# Altium schematic sheet MAX5875_5.SchDoc
size A; SheetNumber: 18; SheetTotal: 24
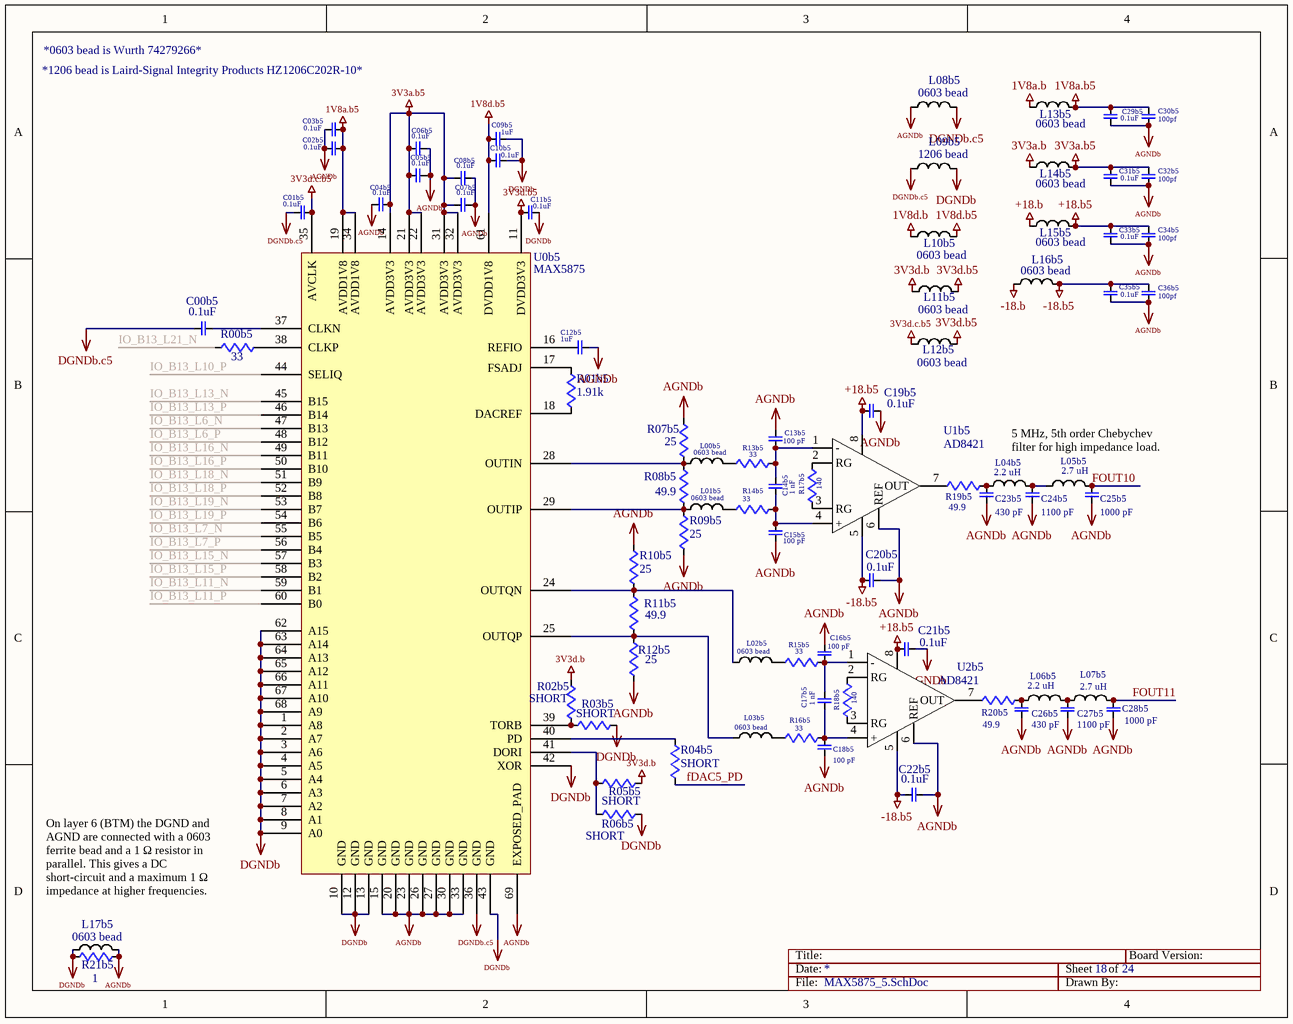
[diagram p0: MAX5875_5.SchDoc]

## Parts
C00b5  0.1uF  [0402]
C01b5  0.1uF  [0402]
C02b5  0.1uF  [0402]
C03b5  0.1uF  [0402]
C04b5  0.1uF  [0402]
C05b5  0.1uF  [0402]
C06b5  0.1uF  [0402]
C07b5  0.1uF  [0402]
C08b5  0.1uF  [0402]
C09b5  1uF  [0603]
C10b5  0.1uF  [0402]
C11b5  0.1uF  [0402]
C12b5  1uF  [0402]
C13b5  100 pF  [0603]
C14b5  1 nF  [0603]
C15b5  100 pF  [0603]
C16b5  100 pF  [0603]
C17b5  1 nF  [0603]
C18b5  100 pF  [0603]
C19b5  0.1uF  [0603]
C20b5  0.1uF  [0603]
C21b5  0.1uF  [0603]
C22b5  0.1uF  [0603]
C23b5  430 pF  [0603]
C24b5  1100 pF  [0603]
C25b5  1000 pF  [0603]
C26b5  430 pF  [0603]
C27b5  1100 pF  [0603]
C28b5  1000 pF  [0603]
C29b5  0.1uF  [0603]
C30b5  100pf  [0603]
C31b5  0.1uF  [0603]
C32b5  100pf  [0603]
C33b5  0.1uF  [0603]
C34b5  100pf  [0603]
C35b5  0.1uF  [0603]
C36b5  100pf  [0603]
L00b5  0603 bead  [0603]
L01b5  0603 bead  [0603]
L02b5  0603 bead  [0603]
L03b5  0603 bead  [0603]
L04b5  2.2 uH  [0603]
L05b5  2.7 uH  [0603]
L06b5  2.2 uH  [0603]
L07b5  2.7 uH  [0603]
L08b5  0603 bead  [0603]
L09b5  1206 bead  [1206]
L10b5  0603 bead  [0603]
L11b5  0603 bead  [0603]
L12b5  0603 bead  [0603]
L13b5  0603 bead  [0603]
L14b5  0603 bead  [0603]
L15b5  0603 bead  [0603]
L16b5  0603 bead  [0603]
L17b5  0603 bead  [0603]
R00b5  33  [0402]
R01b5  1.91k  [0603]
R02b5  SHORT  [0603]
R03b5  SHORT  [0603]
R04b5  SHORT  [0603]
R05b5  SHORT  [0603]
R06b5  SHORT  [0603]
R07b5  25  [0603]
R08b5  49.9  [0603]
R09b5  25  [0603]
R10b5  25  [0603]
R11b5  49.9  [0603]
R12b5  25  [0603]
R13b5  33  [0603]
R14b5  33  [0603]
R15b5  33  [0603]
R16b5  33  [0603]
R17b5  140  [0402]
R18b5  140  [0402]
R19b5  49.9  [0603]
R20b5  49.9  [0603]
R21b5  1  [0603]
U0b5  MAX5875  [68LQFN]
U1b5  AD8421  [8SOIC]
U2b5  AD8421  [8SOIC]

## Nets
1V8a.b: L13b5.1
1V8a.b5: C02b5.1 C03b5.2 C29b5.1 C30b5.1 L13b5.2 U0b5.19(AVDD1V8) U0b5.34(AVDD1V8)
1V8d.b: L10b5.1
1V8d.b5: C09b5.2 C10b5.2 L10b5.2 U0b5.61(DVDD1V8)
3V3a.b: L14b5.1
3V3a.b5: C04b5.1 C05b5.2 C06b5.1 C07b5.2 C08b5.1 C31b5.1 C32b5.1 L14b5.2 U0b5.14(AVDD3V3) U0b5.21(AVDD3V3) U0b5.22(AVDD3V3) U0b5.31(AVDD3V3) U0b5.32(AVDD3V3)
3V3d.b: L11b5.1 R02b5.2 R05b5.2
3V3d.b5: C11b5.2 L11b5.2 L12b5.2 U0b5.11(DVDD3V3)
3V3d.c.b5: C01b5.1 L12b5.1 U0b5.35(AVCLK)
+18.b: L15b5.1
+18.b5: C19b5.2 C21b5.2 C33b5.1 C34b5.1 L15b5.2 U1b5.8(+VS) U2b5.8(+VS)
-18.b: L16b5.1
-18.b5: C20b5.2 C22b5.2 C35b5.1 C36b5.1 L16b5.2 U1b5.5(-VS) U2b5.5(-VS)
AGNDb: C02b5.2 C03b5.1 C04b5.2 C05b5.1 C06b5.2 C07b5.1 C08b5.2 C12b5.1 C13b5.1 C15b5.1 C16b5.1 C18b5.1 C19b5.1 C20b5.1 C21b5.1 C22b5.1 C23b5.2 C24b5.2 C25b5.2 C26b5.2 C27b5.2 C28b5.2 C29b5.2 C30b5.2 C31b5.2 C32b5.2 C33b5.2 C34b5.2 C35b5.2 C36b5.2 L08b5.1 L17b5.2 R07b5.2 R09b5.1 R10b5.2 R12b5.1 R21b5.1 U0b5.15(GND) U0b5.20(GND) U0b5.23(GND) U0b5.26(GND) U0b5.27(GND) U0b5.30(GND) U0b5.33(GND) U0b5.69(EXPOSED_PAD) U1b5.6(REF) U2b5.6(REF)
DGNDb: C09b5.1 C10b5.1 C11b5.1 L09b5.2 L17b5.1 R03b5.2 R06b5.2 R21b5.2 U0b5.1(A8) U0b5.2(A7) U0b5.3(A6) U0b5.4(A5) U0b5.5(A4) U0b5.6(A3) U0b5.7(A2) U0b5.8(A1) U0b5.9(A0) U0b5.10(GND) U0b5.12(GND) U0b5.13(GND) U0b5.42(XOR) U0b5.43(GND) U0b5.62(A15) U0b5.63(A14) U0b5.64(A13) U0b5.65(A12) U0b5.66(A11) U0b5.67(A10) U0b5.68(A9)
DGNDb.c5: C00b5.2 C01b5.2 L08b5.2 L09b5.1 U0b5.36(GND)
fDAC5_PD: R04b5.2
FOUT10: C25b5.1 L05b5.2
FOUT11: C28b5.1 L07b5.2
IO_B13_L6_N: U0b5.47(B13)
IO_B13_L6_P: U0b5.48(B12)
IO_B13_L7_N: U0b5.55(B5)
IO_B13_L7_P: U0b5.56(B4)
IO_B13_L10_P: U0b5.44(SELIQ)
IO_B13_L11_N: U0b5.59(B1)
IO_B13_L11_P: U0b5.60(B0)
IO_B13_L13_N: U0b5.45(B15)
IO_B13_L13_P: U0b5.46(B14)
IO_B13_L15_N: U0b5.57(B3)
IO_B13_L15_P: U0b5.58(B2)
IO_B13_L16_N: U0b5.49(B11)
IO_B13_L16_P: U0b5.50(B10)
IO_B13_L18_N: U0b5.51(B9)
IO_B13_L18_P: U0b5.52(B8)
IO_B13_L19_N: U0b5.53(B7)
IO_B13_L19_P: U0b5.54(B6)
IO_B13_L21_N: R00b5.1
NetC00b5_1: C00b5.1 U0b5.37(CLKN)
NetC12b5_2: C12b5.2 U0b5.16(REFIO)
NetC13b5_2: C13b5.2 C14b5.1 R13b5.1 U1b5.1(-)
NetC14b5_2: C14b5.2 C15b5.2 R14b5.1 U1b5.4(+)
NetC16b5_2: C16b5.2 C17b5.1 R15b5.1 U2b5.1(-)
NetC17b5_2: C17b5.2 C18b5.2 R16b5.1 U2b5.4(+)
NetC23b5_1: C23b5.1 L04b5.1 R19b5.2
NetC24b5_1: C24b5.1 L04b5.2 L05b5.1
NetC26b5_1: C26b5.1 L06b5.1 R20b5.2
NetC27b5_1: C27b5.1 L06b5.2 L07b5.1
NetL00b5_1: L00b5.1 R07b5.1 R08b5.2 U0b5.28(OUTIN)
NetL00b5_2: L00b5.2 R13b5.2
NetL01b5_1: L01b5.1 R08b5.1 R09b5.2 U0b5.29(OUTIP)
NetL01b5_2: L01b5.2 R14b5.2
NetL02b5_1: L02b5.1 R10b5.1 R11b5.2 U0b5.24(OUTQN)
NetL02b5_2: L02b5.2 R15b5.2
NetL03b5_1: L03b5.1 R11b5.1 R12b5.2 U0b5.25(OUTQP)
NetL03b5_2: L03b5.2 R16b5.2
NetR00b5_2: R00b5.2 U0b5.38(CLKP)
NetR01b5_1: R01b5.1 U0b5.18(DACREF)
NetR01b5_2: R01b5.2 U0b5.17(FSADJ)
NetR02b5_1: R02b5.1 R03b5.1 U0b5.39(TORB)
NetR04b5_1: R04b5.1 U0b5.40(PD)
NetR05b5_1: R05b5.1 R06b5.1 U0b5.41(DORI)
NetR17b5_1: R17b5.1 U1b5.3(RG)
NetR17b5_2: R17b5.2 U1b5.2(RG)
NetR18b5_1: R18b5.1 U2b5.3(RG)
NetR18b5_2: R18b5.2 U2b5.2(RG)
NetR19b5_1: R19b5.1 U1b5.7(OUT)
NetR20b5_1: R20b5.1 U2b5.7(OUT)

## Notes on the sheet
- *1206 bead is Laird-Signal Integrity Products HZ1206C202R-10*
- *0603 bead is Wurth 74279266*
- 5 MHz, 5th order Chebychev filter for high impedance load.
- On layer 6 (BTM) the DGND and AGND are connected with a 0603 ferrite bead and a 1 Ω resistor in parallel. This gives a DC short-circuit and a maximum 1 Ω impedance at higher frequencies.
- Title:
- Date:
- Sheet
- of
- Board Version:
- File:
- Drawn By:

## Library data of the parts
C00b5 C01b5 C02b5 C03b5 C04b5 C05b5 C06b5 C07b5 C08b5 C09b5 C10b5 C11b5 C12b5 C13b5 C14b5 C15b5 C16b5 C17b5 C18b5 C19b5 C20b5 C21b5 C22b5 C23b5 C24b5 C25b5 C26b5 C27b5 C28b5 C29b5 C30b5 C31b5 C32b5 C33b5 C34b5 C35b5 C36b5 = CAP
L00b5 L01b5 L02b5 L03b5 L04b5 L05b5 L06b5 L07b5 L08b5 L09b5 L10b5 L11b5 L12b5 L13b5 L14b5 L15b5 L16b5 L17b5 = INDUCTOR
R00b5 R01b5 R02b5 R03b5 R04b5 R05b5 R06b5 R07b5 R08b5 R09b5 R10b5 R11b5 R12b5 R13b5 R14b5 R15b5 R16b5 R17b5 R18b5 R19b5 R20b5 R21b5 = RES